# EAGLE design 7SEGSHIELDTHERMISTOR (EAGLE 9.0.0)
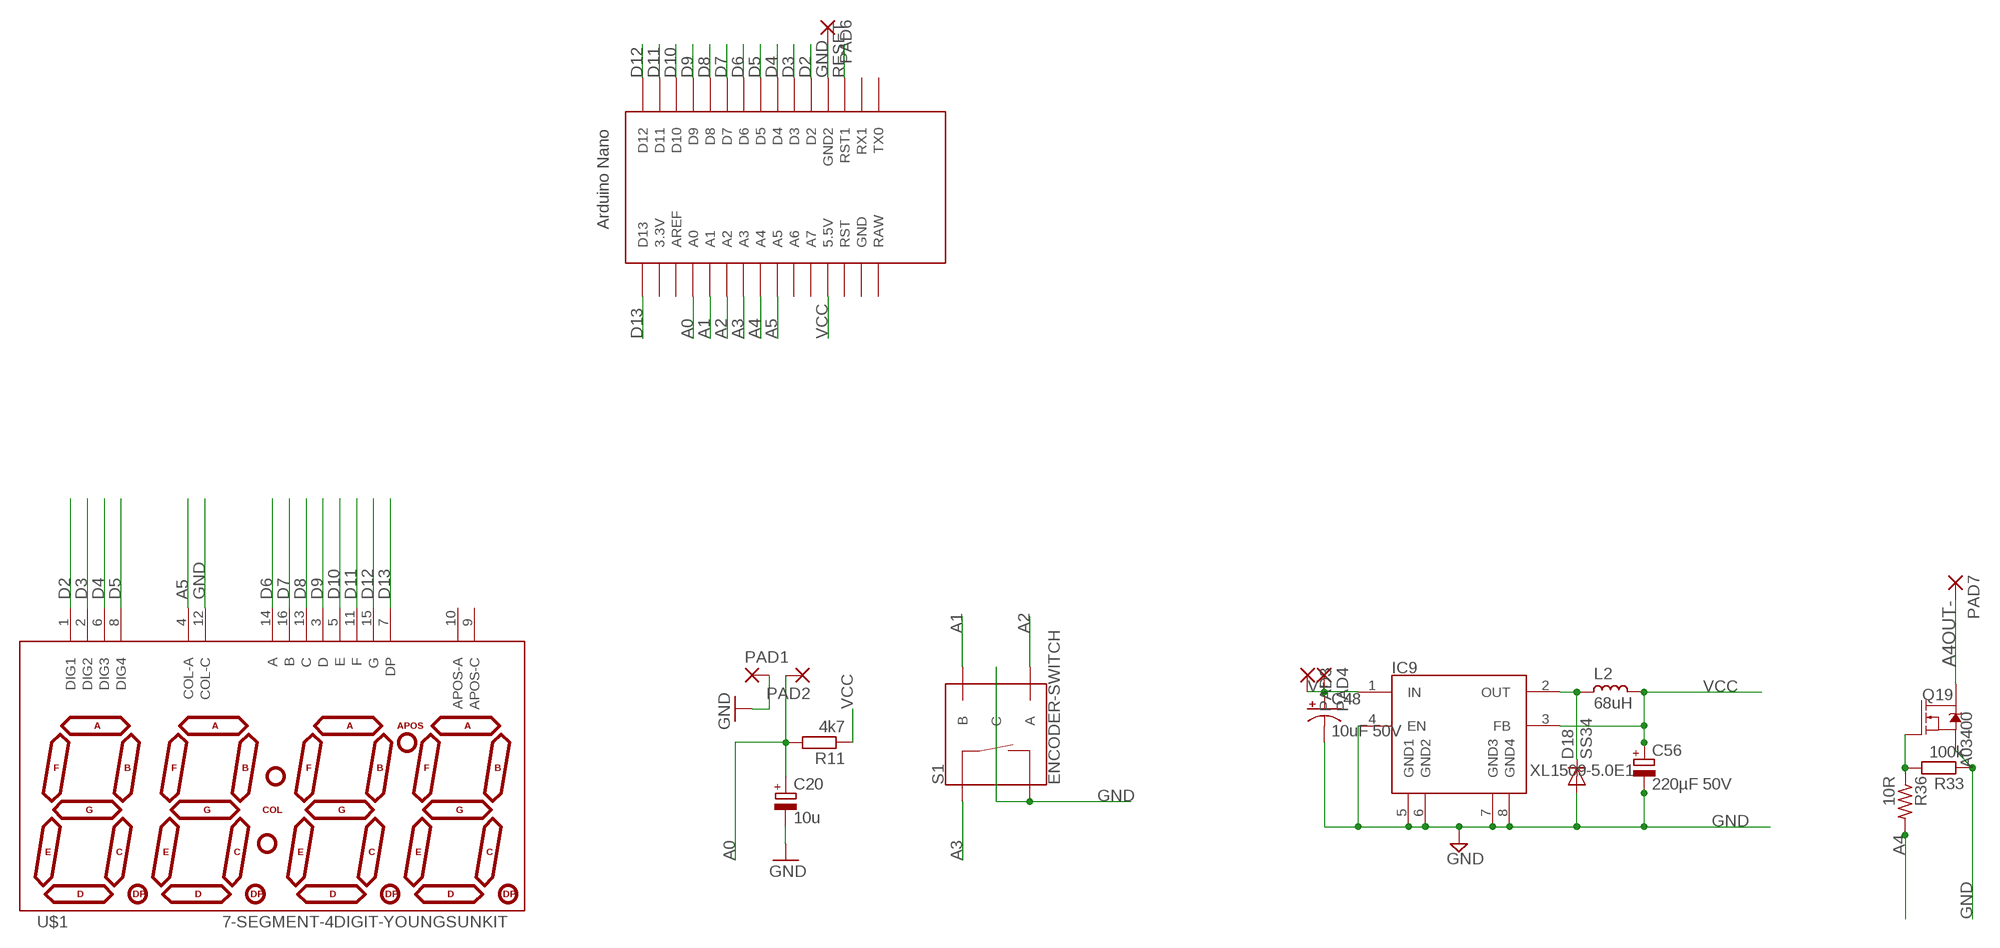
[diagram p0: schematic, sheet 1]

## Parts
C20  10u  CPOL-EUA/3216-18W  [A/3216-18W]
C48  10uF 50V  CAP_POL1206  [EIA3216]
C56  220µF 50V  CPOL-EUE2,5-6E  [E2,5-6E]
D18  SS34  DIODE-DO-214AC  [DO-214AC]
IC9  XL1509-5.0E1  XL1509  [SO08]
L2  68uH  L_CD75  [CD75]
PAD1  2,54/1,1  [2,54/1,1]
PAD2  2,54/1,1  [2,54/1,1]
PAD3  2,54/1,1  [2,54/1,1]
PAD4  2,54/1,1  [2,54/1,1]
PAD6  2,54/1,1  [2,54/1,1]
PAD7  2,54/1,1  [2,54/1,1]
Q19  A03400  MOSFET-NCH-AO3404A  [SOT23-3@1]
R11  4k7  R-EU_M1206  [M1206]
R33  100k  R-EU_R1206  [R1206]
R36  10R  R-US_R1206  [R1206@1]
S1  ENCODER-SWITCH  [ROTARY_ENC_PLAIN]
U$1  7-SEGMENT-4DIGIT-YOUNGSUNKIT  [7-SEGMENT-4DIGIT-YOUNGSUN-KIT]
U$2  NANO  [NANO]

## Nets
A0: C20.+ PAD2.1(P) R11.2 U$2.A0
A1: S1.B U$2.A1
A2: S1.A U$2.A2
A3: S1.SW+ U$2.A3
A4: R36.2 U$2.A4
A4OUT-: PAD7.1(P) Q19.3(D)
A5: U$1.4(COL-A) U$2.A5
D2: U$1.1(DIG1) U$2.D2
D3: U$1.2(DIG2) U$2.D3
D4: U$1.6(DIG3) U$2.D4
D5: U$1.8(DIG4) U$2.D5
D6: U$1.14(A) U$2.D6
D7: U$1.16(B) U$2.D7
D8: U$1.13(C) U$2.D8
D9: U$1.3(D) U$2.D9
D10: U$1.5(E) U$2.D10
D11: U$1.11(F) U$2.D11
D12: U$1.15(G) U$2.D12
D13: U$1.7(DP) U$2.D13
GND: C20.- C48.C(-) C56.- D18.2(A) IC9.4(EN) IC9.5(GND1) IC9.6(GND2) IC9.7(GND3) IC9.8(GND4) PAD1.1(P) PAD6.1(P) Q19.2(S) R33.1 S1.C S1.SW- U$1.12(COL-C) U$2.GND1(GND2)
N$4: D18.1(C) IC9.2(OUT) L2.2
N$83: Q19.1(G) R33.2 R36.1
RESET: U$2.RST1
V+: C48.A(+) IC9.1(IN) PAD3.1(P) PAD4.1(P)
VCC: C56.+ IC9.3(FB) L2.1 R11.1 U$2.5V(5.5V)
Unconnected: U$1.9(APOS-C) U$1.10(APOS-A) U$2.3.3V U$2.A6 U$2.A7 U$2.AREF U$2.GND U$2.ICSP1 U$2.ICSP2 U$2.ICSP3 U$2.ICSP4 U$2.ICSP5 U$2.ICSP6 U$2.RAW U$2.RST U$2.RX1 U$2.TX0

## Library data of the parts
C20 C56 = rcl:CPOL-EU: POLARIZED CAPACITOR, European symbol
C48 = SparkFun:CAP_POL: Capacitor Polarized These are standard SMD and PTH capacitors. Normally 10uF, 47uF, and 100uF in electrolytic and tantalum varieties. Always verify the external diameter of the through hole cap, it varies with capacity, voltage, and manufacturer. The EIA devices should be standard.
D18 = dp_devices:DIODE: Various Diode Packages
IC9 = Cohesion_parts:XL1509
L2 = rc-master-smd:L_: INDUCTOR
PAD1-PAD4 PAD6 PAD7 = wirepad:2,54/1,1: THROUGH-HOLE PAD
Q19 = SparkFun-DiscreteSemi:MOSFET-NCH: N-channel MOSFETs Voltage controlled devices that allow control of high current outputs. SparkFun Products: SparkFun OpenScale <https://www.sparkfun.com/products/13261> SparkFun Digital Sandbox <https://www.sparkfun.com/products/12651> SparkFun Monster Moto Shield <https://www.sparkfun.com/products/10182> SparkFun MOSFET Power Controller <https://www.sparkfun.com/products/11214>; PROD_ID: TRANS-12988; VALUE: 5.8A/30V/35mΩ
R11 R33 = resistor:R-EU_: RESISTOR, European symbol
R36 = rcl:R-US_: RESISTOR, American symbol
S1 = SparkFun-Switches:ENCODER-SWITCH: Rotary Encoder w/ Select Switch Encoders rotate similarly to potentiometers, but they’re different from potentiometers in that an encoder has full rotation without limits. They output gray code so that you can tell how much and in which direction the encoder has been turned. This encoder includes a push-down select switch built into the shaft. SparkFun Products Rotary Encoder <https://www.sparkfun.com/products/9117> (COM-09117); SF_SKU: COM-09117
U$1 = Testing:7-SEGMENT-4DIGIT-YOUNGSUN: This is a part for the 4-Digit 7-segment LEDs from Young Sun. Different from the Digikey LEDs, all 16 pins are used. The LONGPADS Variant is used for a test jig, but you may like it because there is more pad to solder to. If you are concerned about routing space, the standard works just fine though.
U$2 = Arduino-clone:NANO: Arduino Nano

## Net classes
0 default: width 0.254 mm, clearance 0.152 mm

## Board
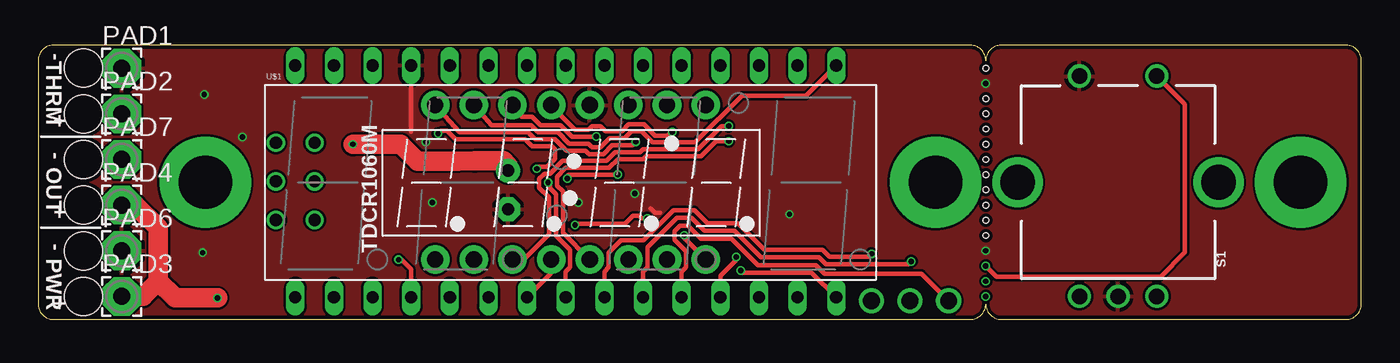
[diagram p1: board, top side]
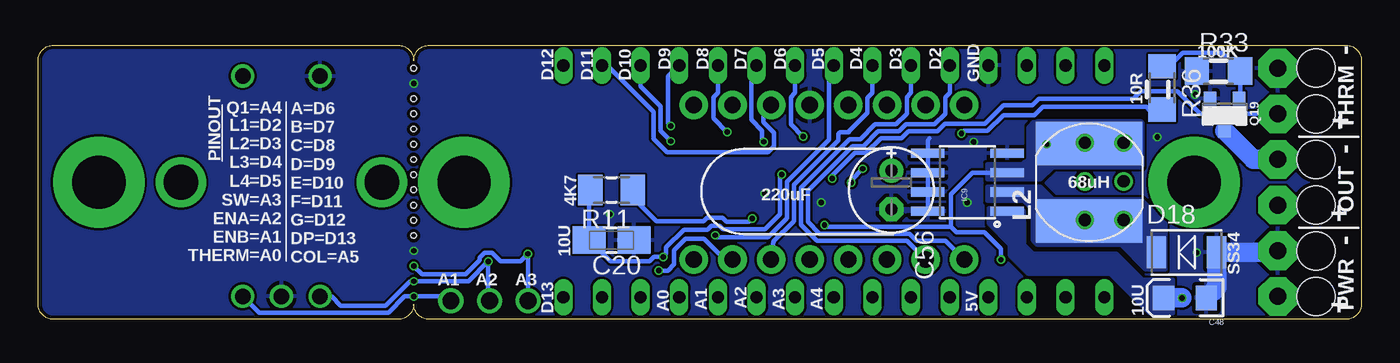
[diagram p2: board, bottom side, seen from below]

Size 87 x 18 mm. Coordinates in mm from the lower left corner, seen from the top.
Outline: 86,18 63.3,18 arc90 62.3,17 arc90 61.3,18 1,18 arc90 0,17 0,1 arc90 1,0 61.3,0 arc90 62.3,1 arc90 63.3,0 86,0 arc90 87,1 87,17 arc90 86,18
Copper layers (1*16): Top 0.035mm / dielectric 0.2mm / Bottom 0.035mm
Design rules "SeeedStudio_4layer_DRU_no_angle_20140221 *": minimum track width 8mil, minimum drill 12mil, track to track 6mil, track to pad 6mil, pad to pad 6mil, via to via 6mil, smd to smd 0mil, copper to edge 10mil, drill to drill 8mil, minimum pad ring 6mil, minimum via ring 4mil, stop-mask expansion 4mil, vias tented up to drill 25mil, thermal gap 10mil
Holes 2.5 mm at 3,1.5 3,4.5 3,7.5 3,10.5 3,13.5 3,16.5
Holes 0.35 mm at 62.3,8.5 62.3,9.5 62.3,10.5 62.3,11.5 62.3,12.5 62.3,13.5 62.3,14.5 62.3,16.5 62.3,7.5 62.3,6.5 62.3,5.5

### Footprints (pad centres in the part's own frame; a part is rotated, then mirrored left to right if it is on the bottom)
A/3216-18W = smd 2.15 x 1.8: + 1.475,0; - -1.475,0
EIA3216 = smd 1.4 x 1.6: A 1.4,0; C -1.4,0
E2,5-6E = drill 0.813 pad 1.575: + -1.27,0 | drill 0.813 pad 1.575 octagon: - 1.27,0
DO-214AC = smd 1.27 x 2.1: 1 -1.98,0; 2 1.98,0
SO08 = smd 0.61 x 2.21: 1 -1.905,-2.616; 2 -0.635,-2.616; 3 0.635,-2.616; 4 1.905,-2.616; 5 1.905,2.616; 6 0.635,2.616; 7 -0.635,2.616; 8 -1.905,2.616
CD75 = smd 7 x 2.85: 1 0,2.54; 2 0,-2.54
2,54/1,1 = drill 1.118 pad 2.54 octagon: 1 0,0
SOT23-3@1 = smd 0.8 x 0.9: 1 -0.95,-1; 2 0.95,-1; 3 0,1.1
M1206 = smd 1.6 x 2: 1 -1.4,0; 2 1.4,0
R1206 = smd 1.6 x 1.803: 1 -1.422,0; 2 1.422,0
R1206@1 = smd 1.6 x 1.803: 1 -1.422,0; 2 1.422,0
ROTARY_ENC_PLAIN = drill 1.016: A 7.493,-2.54; B 7.493,2.54; C 7.493,0; SW+ -6.985,2.54; SW- -6.985,-2.54 | drill 2.286: P$3 0,6.604; P$4 0,-6.604
7-SEGMENT-4DIGIT-YOUNGSUN-KIT = drill 1.067 pad 1.88: 1 -8.89,-5.08; 2 -6.35,-5.08; 3 -3.81,-5.08; 4 -1.27,-5.08; 5 1.27,-5.08; 6 3.81,-5.08; 7 6.35,-5.08; 8 8.89,-5.08; 9 8.89,5.08; 10 6.35,5.08; 11 3.81,5.08; 12 1.27,5.08; 13 -1.27,5.08; 14 -3.81,5.08; 15 -6.35,5.08; 16 -8.89,5.08
NANO = drill 0.8 long: 3.3V -10.16,24.13; 5V -10.16,-1.27; A0 -10.16,19.05; A1 -10.16,16.51; A2 -10.16,13.97; A3 -10.16,11.43; A4 -10.16,8.89; A5 -10.16,6.35; A6 -10.16,3.81; A7 -10.16,1.27; AREF -10.16,21.59; D2 5.08,1.27; D3 5.08,3.81; D4 5.08,6.35; D5 5.08,8.89; D6 5.08,11.43; D7 5.08,13.97; D8 5.08,16.51; D9 5.08,19.05; D10 5.08,21.59; D11 5.08,24.13; D12 5.08,26.67; D13 -10.16,26.67; GND -10.16,-6.35; GND1 5.08,-1.27; RAW -10.16,-8.89; RST -10.16,-3.81; RST1 5.08,-3.81; RX1 5.08,-6.35; TX0 5.08,-8.89 | drill 0.8: ICSP1 -5.08,-10.16; ICSP2 -5.08,-7.62; ICSP3 -2.54,-10.16; ICSP4 -2.54,-7.62; ICSP5 0,-10.16; ICSP6 0,-7.62

### Placement (x,y rotation side)
C20  49.3,5.2 180 bottom
C48  11.6,1.4 180 bottom
C56  30.9,8.5 270 bottom
D18  11.5,4.4 0 bottom
IC9  25.9,9 90 bottom
L2  17.9,9 0 bottom
PAD1  5.5,16.5 0 top
PAD2  5.5,13.5 0 top
PAD3  5.5,1.5 0 top
PAD4  5.5,7.5 0 top
PAD6  5.5,4.5 0 top
PAD7  5.5,10.5 0 top
Q19  9,13.5 180 bottom
R11  49.3,8.5 180 bottom
R33  9.4,16.3 0 bottom
R36  13.1,15.2 270 bottom
S1  71,9 270 top
U$1  35,9 0 top
U$2  25.8,11.6 90 bottom

### Tracks (layer width: path | path; a pad name or v marks a point on that pad's centre or on a via)
A0  (via drill 0.35)
  Top 0.305: v45.89,4.09 45.89,3.89 44.85,2.85 U$2.A0 | v38.11,9.51 37.76,9.51 37.74,9.49 34.87,9.49 34.8,9.42 v34.8,9.24
  Bottom 0.305: R11.2 50.77,8.43 C20.+ 49.38,3.8 46.8,3.8 46.51,4.09 45.91,4.09 | v45.89,4.09 45.91,4.09 | 45.91,4.09 45.71,4.29 45.71,4.73 44.55,5.89 43,5.89 42.74,6.16 42.22,6.16 41.97,5.91 39.22,5.91 38.23,6.9 38.23,9.39 v38.11,9.51 | v34.8,9.24 34.8,9.42 33.28,10.93 32.56,10.93 31.6,11.89 30.23,11.89 29.77,12.34 27.88,12.34 27.39,12.84 24.77,12.84 23.54,14.06 21.64,14.06 21.2,14.5 15,14.5 14.5,15 12.1,15 10.6,13.5 PAD2.1
A1  (via drill 0.35, 1.1)
  Top 0.305: U$2.A1 42.31,3.12 42.59,3.4 42.59,4.49 41.84,5.24 41.84,5.79 42.22,6.16 42.74,6.16 43.59,5.3 45.58,5.3 47.32,3.56 51.14,3.56 51.7,3 58.08,3 v59.86,1.22
  Bottom 0.305: S1.B 72.47,0.44 63.96,0.44 62.9,1.5 v62.3,1.5 60.14,1.5 v59.86,1.22
A2  (via drill 0.35, 1.1)
  Top 0.305: U$2.A2 39.77,3.12 40.05,3.4 40.05,4.73 41.99,6.66 42.95,6.66 43.06,6.56 43.8,5.81 45.79,5.81 47.53,4.07 51.35,4.07 51.81,3.61 57.21,3.61 v57.4,3.8
  Bottom 0.305: S1.A 67.71,1.51 67.1,0.9 64.15,0.9 62.55,2.5 v62.3,2.5 58.7,2.5 v57.4,3.8 57.4,1.3 v57.32,1.22
A3  (via drill 0.35, 1.1)
  Top 0.305: U$2.A3 37.23,3.12 37.52,3.4 37.52,4.38 38.33,5.2 39.81,5.2 41.78,7.17 43.16,7.17 44.02,6.32 46,6.32 47.74,4.58 51.56,4.58 52.02,4.12 54.62,4.12 v54.8,4.3 | S1.SW+ 75.4,14.12 75.4,4.4 73.8,2.8 63,2.8 v62.3,3.5
  Bottom 0.305: v54.78,1.22 54.8,1.24 v54.8,4.3 55.28,3.82 56.6,3.82 57.16,4.38 57.64,4.38 57.98,4.04 57.98,3.87 58.89,2.96 61.76,2.96 v62.3,3.5
A4  (via drill 0.35)
  Top 0.305: U$2.A4 34.69,3.12 34.98,3.4 34.98,4.57 34.04,5.5 34.04,8.21 33.66,8.6 33.66,8.86 v33.53,8.99 | v32.79,9.89 32.93,10.03 33.47,10.03 34,10.56 34,11.17 33.79,11.38 32.48,11.38 32.02,11.84 27.9,11.84 27.79,11.83 27.71,11.84 27.46,11.84 26.9,12.4 26.5,12.4 v26.3,12.2
  Bottom 0.305: v32.79,9.89 33.53,9.15 v33.53,8.99 | v26.3,12.2 26.12,12.38 24.57,12.38 23.55,13.4 21.51,13.4 20.96,13.96 14.14,13.96 13.86,13.68 R36.2
A4OUT-
  Bottom 1.27: Q19.3 7.1,10.5 PAD7.1
A5
  Top 0.305: U$1.4 33.73,3.02 U$2.A5
D2
  Bottom 0.305: U$2.D2 27.07,14.88 27.36,14.6 27.36,13.51 28.07,12.8 29.96,12.8 30.42,12.34 31.79,12.34 32.75,11.39 33.48,11.39 36.4,8.46 36.4,6.4 35.62,5.62 29.7,5.62 29.25,5.17 27.36,5.17 U$1.1
D3
  Bottom 0.305: U$2.D3 29.61,14.88 29.89,14.6 29.89,13.51 30.61,12.8 31.98,12.8 32.94,11.84 33.66,11.84 36.86,8.65 36.86,6.21 35.81,5.17 29.89,5.17 U$1.2
D4
  Bottom 0.305: U$1.6 38.64,5.11 37.31,6.44 37.31,8.84 34.4,11.76 34.4,12.2 34.3,12.3 33.7,12.3 33.7,12.35 32.48,13.56 32.48,14.54 32.15,14.88 U$2.D4
D5  (via drill 0.35)
  Top 0.305: v42.48,5.52 42.48,5.35 43.89,3.94 U$1.8
  Bottom 0.305: v42.48,5.52 42.35,5.4 39,5.4 37.77,6.63 37.77,9.03 35,11.8 35,16.37 U$2.D5
D6  (via drill 0.35)
  Top 0.305: v36.7,12 35.11,12 34.36,12.76 33.04,12.76 32.49,13.31 31.79,13.31 U$1.14
  Bottom 0.305: U$2.D6 37.23,14.88 37.52,14.6 37.52,12.81 v36.7,12
D7  (via drill 0.35)
  Top 0.305: v39.3,11.66 39.07,11.43 37.75,11.43 37.17,10.86 36.23,10.86 36,11.09 34.73,11.09 33.98,11.84 32.67,11.84 32.21,12.3 27.72,12.3 U$1.16
  Bottom 0.305: v39.3,11.66 39.4,11.76 39.4,12.4 40.1,13.1 40.1,16.35 U$2.D7
D8  (via drill 0.35)
  Top 0.305: v41.7,12.3 41.6,12.3 41.37,12.07 40.57,12.07 39.85,12.8 38.83,12.8 38.38,12.35 37.32,12.35 36.98,12.68 36.42,12.68 36.19,12.46 35.3,12.46 33.68,14.08 U$1.13
  Bottom 0.305: U$2.D8 42.31,14.88 42.59,14.6 42.59,13.2 v41.7,12.3
D9  (via drill 0.35)
  Top 0.305: v45.4,12.7 44.93,12.7 43.39,11.16 39.77,11.16 39.58,10.98 37.94,10.98 37.36,10.4 34.49,10.4 33.66,9.57 33.29,9.57 32.95,9.23 32.95,8.65 33.59,8.02 33.59,5.59 31.92,3.92 U$1.3
  Bottom 0.305: v45.4,12.7 45.58,12.88 45.58,15.96 U$2.D9
D10  (via drill 0.35)
  Top 0.305: v45.4,11.7 44.57,11.7 43.58,10.7 39.95,10.7 39.77,10.52 38.12,10.52 37.55,9.95 34.68,9.95 34.11,9.38 34.11,8.79 34.5,8.4 34.5,5.69 U$1.5
  Bottom 0.305: v45.4,11.7 46.08,12.38 46.08,13.98 47.4,15.3 U$2.D10
D11
  Bottom 0.305: U$1.11 39.3,13.54 39.3,12.95 38.62,12.26 38.62,11.38 39.02,10.98 45.64,10.98 46.54,11.87 46.54,13.64 49.58,16.68 U$2.D11
D12
  Top 0.305: U$2.D12 50.49,14.7 46.28,14.7 43.2,11.62 40.38,11.62 39.66,12.34 39.02,12.34 38.56,11.89 37.56,11.89 36.98,11.32 36.42,11.32 36.19,11.54 34.92,11.54 34.17,12.3 32.85,12.3 32.4,12.76 29.8,12.76 U$1.15
D13  (via drill 0.35)
  Top 0.305: U$2.D13 50.86,3.05 46.35,3.05 v46.2,3.2
  Bottom 0.305: U$1.7 41.96,4.04 43.2,5.29 44.44,5.29 45.2,4.52 45.2,3.6 45.6,3.2 v46.2,3.2
GND  (via drill 0.35)
  Top 0.305: 40.89,7 40.56,7 40.25,7.31 | 24.6,16.61 U$2.GND1 24.53,12.32
  Bottom 0.305: IC9.8 IC9.7 IC9.6 IC9.5 28.52,11.77 28.4,11.89 | IC9.4 23.28,10.94
  Bottom 1.27: PAD6.1 5.6,4.4 D18.2 9.52,2.08 C48.C
  other vias: 25.5,11.65 10.93,14.78 10.82,4.38 25.93,7.67 62.3,4.5 62.3,15.5 49.4,6.9 35.52,7.67 39.23,8.28 13.43,11.97
  pour Bottom (rank 6): 0,18 87,18 87,0 0,0
  pour Top (rank 6): 0,18 87,18 87,0 0,0
N$1  (via drill 3.5 pad 6)
  other vias: 59,9
N$2  (via drill 3.5 pad 6)
  other vias: 11,9
N$3  (via drill 3.5 pad 6)
  other vias: 83,9
N$4
  pour Bottom (no thermals): 12.9,3.3 14.2,3.3 15.8,4.9 21.3,4.9 21.6,5.2 21.6,7.2 22.2,7.8 24.6,7.8 24.6,8.7 21.1,8.7 20.3,7.9 14.5,7.9 12.9,6.3
N$83
  Bottom 0.305: 8.15,14.6 8.12,14.57 | 8.12,14.57 Q19.1 | R36.1 12.73,16.52 11.75,17.51 9.18,17.51 R33.2 7.98,14.72 8.12,14.57
V+  (via drill 0.35)
  Top 1.27: PAD4.1 6.4,7.5 7.9,6 7.9,2.5 | 7.9,2.5 9,1.4 v11.8,1.4 | PAD3.1 6.9,1.5 7.9,2.5
  Bottom 1.27: v11.8,1.4 C48.A
  pour Bottom (rank 2, no thermals): 12.4,2.6 14.4,2.6 16.1,4.3 21.6,4.3 22.2,4.9 22.2,7.1 22.4,7.3 24.5,7.3 24.5,6.3 23.1,4.9 23.1,4.2 21.9,3 16.5,3 13.9,0.4 12.4,0.4
VCC  (via drill 0.35)
  Top 0.305: U$2.5V 24.53,3.28 23.9,3.91 v23.7,3.91 | v40.04,6.62 39.67,6.62 39.5,6.8 39.1,6.8 38.59,6.29 35.39,6.29 v35.3,6.2
  Top 1.27: C56.+ 30.9,10.1 30.6,10.4 28.7,10.4 27.6,10.4 24.95,10.4 23.85,11.5 v20.7,11.5
  Bottom 0.305: R11.1 47.9,8 46.34,6.44 43.25,6.44 43.03,6.66 42.01,6.66 41.76,6.42 40.25,6.42 v40.04,6.62 | v23.7,3.91 23.7,4.65 24.77,5.72 26.62,5.72 26.98,6.08 | IC9.3 25.57,9.63 26.98,8.22 26.98,6.08 | v35.3,6.2 35.18,6.08 26.98,6.08
  pour Bottom (rank 2, no thermals): 24.6,9.2 21.1,9.2 20.3,10 14.5,10 14.4,10.1 14.4,12.9 14.5,13 21.5,13 21.9,12.6 21.9,10.6 22.3,10.2 24.6,10.2

### Text on the board
tPlace: THRM | - | TDCR1060M | + | OUT | - | + | PWR | - | +
bPlace: - | 100K | THRM | 10R | GND | D2 | D3 | D4 | D5 | D6 | D7 | D8 | D9 | D10 | D11 | D12 | + | Q1=A4 | - | OUT | 4K7 | PINOUT | 68uH | 220uF | L1=D2 / L2=D3 / L3=D4 / L4=D5 | + | - | SS34 | 10U | SW=A3 / ENA=A2 / ENB=A1 | PWR | A=D6 / B=D7 / C=D8 / D=D9 / E=D10 / F=D11 / G=D12 / DP=D13 / COL=A5 | THERM=A0 | + | 10U | A3 | A2 | A1 | A4 | A3 | A2 | A1 | 5V | A0 | D13